# Altium schematic sheet SUBBOARD-boost_filter_3p_LCL.SchDoc
size A4
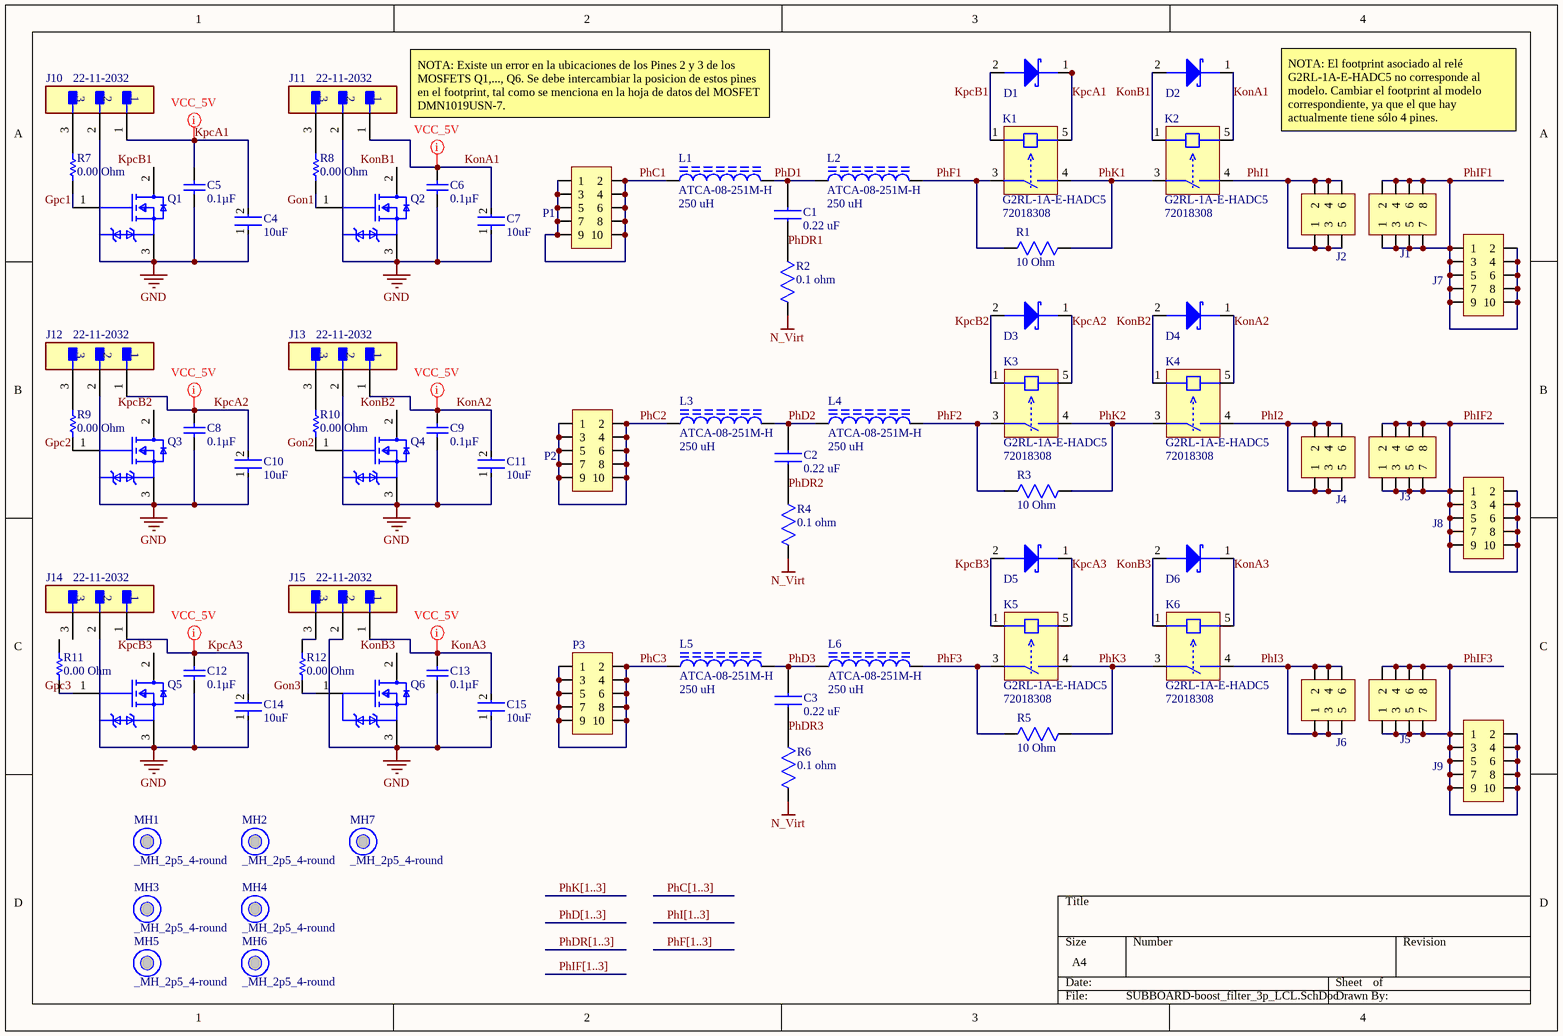
[diagram p0: SUBBOARD-boost_filter_3p_LCL.SchDoc]

## Parts
C1  Capacitance: 0.22 uF  [B32652XXXXX]  (hidden comment: B32652A6224K)
C2  Capacitance: 0.22 uF  [B32652XXXXX]  (hidden comment: B32652A6224K)
C3  Capacitance: 0.22 uF  [B32652XXXXX]  (hidden comment: B32652A6224K)
C4  value 10uF  [FP-GRT31-0_2-MFG]  (hidden comment: GRT31CR61H106KE01L)
C5  Capacitance: 0.1µF  [SAMS-C0603-2_L]  (hidden comment: CL10B104KB8NNNC)
C6  Capacitance: 0.1µF  [SAMS-C0603-2_L]  (hidden comment: CL10B104KB8NNNC)
C7  value 10uF  [FP-GRT31-0_2-MFG]  (hidden comment: GRT31CR61H106KE01L)
C8  Capacitance: 0.1µF  [SAMS-C0603-2_L]  (hidden comment: CL10B104KB8NNNC)
C9  Capacitance: 0.1µF  [SAMS-C0603-2_L]  (hidden comment: CL10B104KB8NNNC)
C10  value 10uF  [FP-GRT31-0_2-MFG]  (hidden comment: GRT31CR61H106KE01L)
C11  value 10uF  [FP-GRT31-0_2-MFG]  (hidden comment: GRT31CR61H106KE01L)
C12  Capacitance: 0.1µF  [SAMS-C0603-2_L]  (hidden comment: CL10B104KB8NNNC)
C13  Capacitance: 0.1µF  [SAMS-C0603-2_L]  (hidden comment: CL10B104KB8NNNC)
C14  value 10uF  [FP-GRT31-0_2-MFG]  (hidden comment: GRT31CR61H106KE01L)
C15  value 10uF  [FP-GRT31-0_2-MFG]  (hidden comment: GRT31CR61H106KE01L)
D1  BYG23T-M3/TR  [BYG23T-M3/TR]  (value not drawn)
D2  BYG23T-M3/TR  [BYG23T-M3/TR]  (value not drawn)
D3  BYG23T-M3/TR  [BYG23T-M3/TR]  (value not drawn)
D4  BYG23T-M3/TR  [BYG23T-M3/TR]  (value not drawn)
D5  BYG23T-M3/TR  [BYG23T-M3/TR]  (value not drawn)
D6  BYG23T-M3/TR  [BYG23T-M3/TR]  (value not drawn)
J1  SSW-104-01-G-D  [SSW-104-01-G-D]  (value not drawn)
J2  SSW-103-01-G-D  [SSW-103-01-G-D]  (value not drawn)
J3  SSW-104-01-G-D  [SSW-104-01-G-D]  (value not drawn)
J4  SSW-103-01-G-D  [SSW-103-01-G-D]  (value not drawn)
J5  SSW-104-01-G-D  [SSW-104-01-G-D]  (value not drawn)
J6  SSW-103-01-G-D  [SSW-103-01-G-D]  (value not drawn)
J7  IPS1-105-01-L-D-RA  [IPS1-105-01-L-D-RA]  (value not drawn)
J8  IPS1-105-01-L-D-RA  [IPS1-105-01-L-D-RA]  (value not drawn)
J9  IPS1-105-01-L-D-RA  [IPS1-105-01-L-D-RA]  (value not drawn)
J10  22-11-2032  [FP-22-11-2032-MFG]
J11  22-11-2032  [FP-22-11-2032-MFG]
J12  22-11-2032  [FP-22-11-2032-MFG]
J13  22-11-2032  [FP-22-11-2032-MFG]
J14  22-11-2032  [FP-22-11-2032-MFG]
J15  22-11-2032  [FP-22-11-2032-MFG]
K1  G2RL-1A-E-HADC5  Supplier Part Number 1: 72018308  [G2RL-1A-E-HA DC5]
K2  G2RL-1A-E-HADC5  Supplier Part Number 1: 72018308  [G2RL-1A-E-HA DC5]
K3  G2RL-1A-E-HADC5  Supplier Part Number 1: 72018308  [G2RL-1A-E-HA DC5]
K4  G2RL-1A-E-HADC5  Supplier Part Number 1: 72018308  [G2RL-1A-E-HA DC5]
K5  G2RL-1A-E-HADC5  Supplier Part Number 1: 72018308  [G2RL-1A-E-HA DC5]
K6  G2RL-1A-E-HADC5  Supplier Part Number 1: 72018308  [G2RL-1A-E-HA DC5]
L1  ATCA-08-251M-H  Inductance: 250 uH  [ATCA-08-251M-H]
L2  ATCA-08-251M-H  Inductance: 250 uH  [ATCA-08-251M-H]
L3  ATCA-08-251M-H  Inductance: 250 uH  [ATCA-08-251M-H]
L4  ATCA-08-251M-H  Inductance: 250 uH  [ATCA-08-251M-H]
L5  ATCA-08-251M-H  Inductance: 250 uH  [ATCA-08-251M-H]
L6  ATCA-08-251M-H  Inductance: 250 uH  [ATCA-08-251M-H]
MH1  _MH_2p5_4-round  [_MH_2p5_4-round]
MH2  _MH_2p5_4-round  [_MH_2p5_4-round]
MH3  _MH_2p5_4-round  [_MH_2p5_4-round]
MH4  _MH_2p5_4-round  [_MH_2p5_4-round]
MH5  _MH_2p5_4-round  [_MH_2p5_4-round]
MH6  _MH_2p5_4-round  [_MH_2p5_4-round]
MH7  _MH_2p5_4-round  [_MH_2p5_4-round]
P1  IPT1-105-01-S-D-RA  [IPT1-105-01-S-D-RA]  (value not drawn)
P2  IPT1-105-01-S-D-RA  [IPT1-105-01-S-D-RA]  (value not drawn)
P3  IPT1-105-01-S-D-RA  [IPT1-105-01-S-D-RA]  (value not drawn)
Q1  DMN1019USN-7  [FP-SC59-IPC_B]  (value not drawn)
Q2  DMN1019USN-7  [FP-SC59-IPC_B]  (value not drawn)
Q3  DMN1019USN-7  [FP-SC59-IPC_B]  (value not drawn)
Q4  DMN1019USN-7  [FP-SC59-IPC_B]  (value not drawn)
Q5  DMN1019USN-7  [FP-SC59-IPC_B]  (value not drawn)
Q6  DMN1019USN-7  [FP-SC59-IPC_B]  (value not drawn)
R1  Resistance: 10 Ohm  [RES_WH/NE]  (hidden comment: WHE10RFET)
R2  Resistance: 0.1 ohm  [WSR-L]  (hidden comment: WSR5R1000FEA)
R3  Resistance: 10 Ohm  [RES_WH/NE]  (hidden comment: WHE10RFET)
R4  Resistance: 0.1 ohm  [WSR-L]  (hidden comment: WSR5R1000FEA)
R5  Resistance: 10 Ohm  [RES_WH/NE]  (hidden comment: WHE10RFET)
R6  Resistance: 0.1 ohm  [WSR-L]  (hidden comment: WSR5R1000FEA)
R7  value 0.00 Ohm  [RESC0603(1608)_L]  (hidden comment: Jumper 0603(1608))
R8  value 0.00 Ohm  [RESC0603(1608)_L]  (hidden comment: Jumper 0603(1608))
R9  value 0.00 Ohm  [RESC0603(1608)_L]  (hidden comment: Jumper 0603(1608))
R10  value 0.00 Ohm  [RESC0603(1608)_L]  (hidden comment: Jumper 0603(1608))
R11  value 0.00 Ohm  [RESC0603(1608)_L]  (hidden comment: Jumper 0603(1608))
R12  value 0.00 Ohm  [RESC0603(1608)_L]  (hidden comment: Jumper 0603(1608))

## Nets
GND: C4.1 C5.2 C6.2 C7.1 C8.2 C9.2 C10.1 C11.1 C12.2 C13.2 C14.1 C15.1 J10.2 J11.2 J12.2 J13.2 J14.2 J15.2 Q1.3(D) Q2.3(D) Q3.3(D) Q4.3(D) Q5.3(D) Q6.3(D)
N_Virt: R2.1 R4.1 R6.1
Gon1: Q2.1(G) R8.2
Gon2: Q4.1(G) R10.2
Gon3: Q6.1(G) R12.2
Gpc1: Q1.1(G) R7.2
Gpc2: Q3.1(G) R9.2
Gpc3: Q5.1(G) R11.2
KonA1: C6.1 C7.2 D2.1(Cathode) J11.1 K2.5
KonA2: C9.1 C11.2 D4.1(Cathode) J13.1 K4.5
KonA3: C13.1 C15.2 D6.1(Cathode) J15.1 K6.5
KonB1: D2.2(Anode) K2.1 Q2.2(S)
KonB2: D4.2(Anode) K4.1 Q4.2(S)
KonB3: D6.2(Anode) K6.1 Q6.2(S)
KpcA1: C4.2 C5.1 D1.1(Cathode) J10.1 K1.5
KpcA2: C8.1 C10.2 D3.1(Cathode) J12.1 K3.5
KpcA3: C12.1 C14.2 D5.1(Cathode) J14.1 K5.5
KpcB1: D1.2(Anode) K1.1 Q1.2(S)
KpcB2: D3.2(Anode) K3.1 Q3.2(S)
KpcB3: D5.2(Anode) K5.1 Q5.2(S)
PhC1: L1.1 P1.1 P1.2 P1.3 P1.4 P1.5 P1.6 P1.7 P1.8 P1.9 P1.10
PhC2: L3.1 P2.1 P2.2 P2.3 P2.4 P2.5 P2.6 P2.7 P2.8 P2.9 P2.10
PhC3: L5.1 P3.1 P3.2 P3.3 P3.4 P3.5 P3.6 P3.7 P3.8 P3.9 P3.10
PhD1: C1.2 L1.2 L2.1
PhD2: C2.2 L3.2 L4.1
PhD3: C3.2 L5.2 L6.1
PhDR1: C1.1 R2.2
PhDR2: C2.1 R4.2
PhDR3: C3.1 R6.2
PhF1: K1.3 L2.2 R1.1
PhF2: K3.3 L4.2 R3.1
PhF3: K5.3 L6.2 R5.1
PhI1: J2.1 J2.2 J2.3 J2.4 J2.5 J2.6 K2.4
PhI2: J4.1 J4.2 J4.3 J4.4 J4.5 J4.6 K4.4
PhI3: J6.1 J6.2 J6.3 J6.4 J6.5 J6.6 K6.4
PhIF1: J1.1 J1.2 J1.3 J1.4 J1.5 J1.6 J1.7 J1.8 J7.1 J7.2 J7.3 J7.4 J7.5 J7.6 J7.7 J7.8 J7.9 J7.10
PhIF2: J3.1 J3.2 J3.3 J3.4 J3.5 J3.6 J3.7 J3.8 J8.1 J8.2 J8.3 J8.4 J8.5 J8.6 J8.7 J8.8 J8.9 J8.10
PhIF3: J5.1 J5.2 J5.3 J5.4 J5.5 J5.6 J5.7 J5.8 J9.1 J9.2 J9.3 J9.4 J9.5 J9.6 J9.7 J9.8 J9.9 J9.10
PhK1: K1.4 K2.3 R1.2
PhK2: K3.4 K4.3 R3.2
PhK3: K5.4 K6.3 R5.2
NetJ10_3: J10.3 R7.1
NetJ11_3: J11.3 R8.1
NetJ12_3: J12.3 R9.1
NetJ13_3: J13.3 R10.1
NetJ15_3: J15.3 R12.1

Not connected (* = marked no-connect by the designer): J14 3; R11 1

## Buses and harness runs
bus PhC[1..3]
bus PhD[1..3]
bus PhDR[1..3]
bus PhF[1..3]
bus PhI[1..3]
bus PhIF[1..3]
bus PhK[1..3]

## Layout directives
mark named VCC_5V: KonA1, KonA2, KonA3, KpcA1, KpcA2, KpcA3

## Notes on the sheet
- NOTA: Existe un error en la ubicaciones de los Pines 2 y 3 de los MOSFETS Q1,..., Q6. Se debe intercambiar la posicion de estos pines en el footprint, tal como se menciona en la hoja de datos del MOSFET DMN1019USN-7.
- NOTA: El footprint asociado al relé G2RL-1A-E-HADC5 no corresponde al modelo. Cambiar el footprint al modelo correspondiente, ya que el que hay actualmente tiene sólo 4 pines.

## Library data of the parts
C1-C3 = B32652A6224K: Film Capacitors 0.22uF 630volts 5%; Vendor: Epcos; Built_By: EMA_UL_Team; Type: DEV; Voltage Rating AC: 250 VAC; Voltage Rating DC: 630 VDC; Manufacturer_Part_Number: B32652A6224K; Copyright: Copyright (C) 2018 Accelerated Designs. All rights reserved; RefDes: RefDes; Value: Value; Supplier 1: Mouser; Supplier 2: Arrow; Supplier Part Number 2: B32652A6224J189; Supplier Part Number 1: 871-B32652A6224J189
C4 C7 C10 C11 C14 C15 = CMP-06035-000076-1: CAP CER 10UF 50V X5R 1206; Manufacturer: Murata; Temperature Coefficient: 15%; Tolerance: 10%; Material: Ceramic; Automotive Grade: Grade 3; Height: 1.8mm; Ipc Land Pattern Name: CAPC320160X160; Octopart: https://octopart.com/grt31cr61h106ke01l-murata-62921736; Digikey Description: CAP CER 10UF 50V X5R 1206; Voltage Rating: 50V; Device Class L3: Ceramic Capacitors; ComponentLink2URL: https://search.murata.co.jp/Ceramy/image/img/A01X/G101/ENG/GRT31CR61H106KE01-01.pdf; Device Class L1: Passive Components; Temperature Range High: +85°C; Lead Free: Yes; Capacitance: 10uF; Manufacturer Part Number: GRT31CR61H106KE01L; Temperature Range Low: -55°C; Temperature Characteristic: X5R; Category: Cap; Automotive: Yes; ComponentLink2Description: Datasheet; Device Class L2: Capacitors; Package: GRT31-0.2; RoHS: TRUE; Temperature: -55°C to +85°C
C5 C6 C8 C9 C12 C13 = CMP-2000-05332-1: Multi-layer Ceramic Capacitor, -55 to 125 degC, 2-Pin SMD (0603), RoHS, Tape and Reel; Manufacturer: Samsung Electro-Mechanics; Rated Voltage: 50V; Dielectric: X7R; Tolerance (%): ±10%; Case Size/Dimension: 0603; Datasheet URL: https://datasheet.ciiva.com/29198/456651-da-01-en-vs-kondensator-0605-29198839.pdf; Manufacturer URL: http://www.samsungsem.com/global/index.jsp; Datasheet Version: Nov-10
D1-D6 = BYG23T-M3/TR: DIODE AVALANCHE 1300V 1A DO214AC; Manufacturer: Vishay Semiconductors; Max Surge Current: 18A; Forward Voltage: 1.9V; Peak Reverse Current: 5uA; Recovery Time: 75ns; Max Repetitive Reverse Voltage (Vrrm): 1.3kV; Zener Voltage: 200V; Max Power Dissipation: 800mW; Element Configuration: Single; Supplier 1: Newark; Manufacturer Part Number: BYG23T-M3/TR; RoHS: Yes; Category: Rectifier Diodes; Stock 1: 6980; Pricing 1: 1=0.16100, 10=0.16100, 25=0.16100, 50=0.16100, 100=0.16100, 250=0.16100, 500=0.16100, 1000=0.14800 (USD); Mount: Surface Mount; Case/Package: SMA; Number of Pins: 2; Contact Plating: Tin,Matte; Min Operating Temperature: -55°C; Max Operating Temperature: 150°C; Packaging: Tape and Reel; Forward Current: 1A; Package Quantity: 1; Average Rectified Current: 1A; Reverse Recovery Time: 75ns; Max Forward Surge Current (Ifsm): 18A; Peak Non-Repetitive Surge Current: 18A; Diode Type: Avalanche; Max Reverse Voltage (DC): 1.3kV; Reverse Voltage: 1.3kV; Length: 4.5mm; Height: 2.29mm; Width: 2.79mm; Radiation Hardening: No; REACH SVHC: Unknown; ComponentLink1URL: https://datasheet.ciiva.com/23642/byg23t-23642320.pdf?src-supplier=Newark; ComponentLink1Description: https://datasheet.ciiva.com/23642/byg23t-23642320.pdf?src-supplier=Newark; ComponentLink2URL: https://datasheet.ciiva.com/30479/0900766b810d43bd-30479333.pdf?src-supplier=RSComponents; ComponentLink2Description: https://datasheet.ciiva.com/30479/0900766b810d43bd-30479333.pdf?src-supplier=RSComponents; ComponentLink3URL: https://datasheet.ciiva.com/4454/byg23t-85630-4454047.pdf?src-supplier=Mouser; ComponentLink3Description: https://datasheet.ciiva.com/4454/byg23t-85630-4454047.pdf?src-supplier=Mouser; ComponentLink4URL: https://datasheet.ciiva.com/920/byg23t-920130.pdf?src-supplier=Digi-Key; ComponentLink4Description: https://datasheet.ciiva.com/920/byg23t-920130.pdf?src-supplier=Digi-Key; ComponentLink5URL: https://datasheet.ciiva.com/920/byg23t-920131.pdf?src-supplier=Digi-Key; ComponentLink5Description: https://datasheet.ciiva.com/920/byg23t-920131.pdf?src-supplier=Digi-Key; ComponentLink6URL: https://datasheet.ciiva.com/920/byg23t-920132.pdf?src-supplier=Digi-Key; ComponentLink6Description: https://datasheet.ciiva.com/920/byg23t-920132.pdf?src-supplier=Digi-Key; ComponentLink7URL: https://datasheet.ciiva.com/1178/byg23t-1178213.pdf?src-supplier=Element14; ComponentLink7Description: https://datasheet.ciiva.com/1178/byg23t-1178213.pdf?src-supplier=Element14; Supplier Part Number 1: 70AC6454
J1 J3 J5 = SSW-104-01-G-D: Conn Socket Strip SKT 8 POS 2.54mm Solder ST Thru-Hole; Manufacturer: Samtec; Number of Contacts: 8; Max Current Rating: 6.9A; Contact Resistance: 10mR; Max Voltage Rating (AC): 550V; Gender: Receptacle; Connector Type: Receptacle,Socket; Mating Cycles: 100; Row Spacing: 0.1inch; Supplier 1: Digi-Key; Manufacturer Part Number: SSW-104-01-G-D; RoHS: Yes; Category: Headers and Wire Housings; Stock 1: 1152; Pricing 1: 1=1.24000, 10=1.09400, 25=1.03000, 50=0.98700, 100=0.94410, 250=0.85824, 500=0.77242 (USD); Mount: Through Hole; Contact Plating: Gold; Contact Material: Bronze; Color: Black; Housing Color: Black; Housing Material: Polymer; Min Operating Temperature: -55°C; Max Operating Temperature: 125°C; Number of Rows: 2; Termination: Solder; Packaging: Bulk; Orientation: Vertical; Number of Positions: 8; Current Rating: 6.9A; Voltage Rating: 550V; Length: 10.67mm; Pitch: 2.54mm; Depth: 4.95mm; Radiation Hardening: No; Lead Free: Lead Free; REACH SVHC: No SVHC; ComponentLink1URL: https://datasheet.ciiva.com/25617/0900766b8115c03d-25617355.pdf?src-supplier=RSComponents; ComponentLink1Description: https://datasheet.ciiva.com/25617/0900766b8115c03d-25617355.pdf?src-supplier=RSComponents; ComponentLink2URL: https://datasheet.ciiva.com/22677/82032-22677624.pdf?src-supplier=Element14; ComponentLink2Description: https://datasheet.ciiva.com/22677/82032-22677624.pdf?src-supplier=Element14; ComponentLink3URL: https://datasheet.ciiva.com/749/ssw-1xx-xx-xxx-x-xx-xxx-xx-mkt-749827.pdf?src-supplier=Digi-Key; ComponentLink3Description: https://datasheet.ciiva.com/749/ssw-1xx-xx-xxx-x-xx-xxx-xx-mkt-749827.pdf?src-supplier=Digi-Key; Supplier Part Number 1: SAM1208-04-ND
J2 J4 J6 = SSW-103-01-G-D: Conn Socket Strip SKT 6 POS 2.54mm Solder ST Thru-Hole; Manufacturer: Samtec; Number of Contacts: 6; Gender: Receptacle; Connector Type: Receptacle,Socket; Contact Resistance: 10mR; Max Current Rating: 6.9A; Max Voltage Rating (AC): 550V; Mating Cycles: 100; Row Spacing: 0.1inch; Supplier 1: Digi-Key; Manufacturer Part Number: SSW-103-01-G-D; RoHS: Yes; Category: Headers and Wire Housings; Stock 1: 1397; Pricing 1: 1=0.93000, 10=0.82100, 25=0.77240, 50=0.74020, 100=0.70800, 250=0.64368, 500=0.57932 (USD); Mount: Through Hole; Contact Plating: Gold; Contact Material: Bronze; Color: Black; Housing Color: Black; Housing Material: Polymer; Min Operating Temperature: -55°C; Max Operating Temperature: 125°C; Number of Rows: 2; Termination: Solder; Packaging: Bulk; Number of Positions: 6; Orientation: Vertical; Current Rating: 6.9A; Voltage Rating: 550V; Length: 8.13mm; Pitch: 2.54mm; Depth: 4.95mm; Radiation Hardening: No; Lead Free: Lead Free; REACH SVHC: No SVHC; ComponentLink1URL: https://datasheet.ciiva.com/25617/0900766b8115c03d-25617399.pdf?src-supplier=RSComponents; ComponentLink1Description: https://datasheet.ciiva.com/25617/0900766b8115c03d-25617399.pdf?src-supplier=RSComponents; ComponentLink2URL: https://datasheet.ciiva.com/22677/82032-22677622.pdf?src-supplier=Element14; ComponentLink2Description: https://datasheet.ciiva.com/22677/82032-22677622.pdf?src-supplier=Element14; ComponentLink3URL: https://datasheet.ciiva.com/749/ssw-1xx-xx-xxx-x-xx-xxx-xx-mkt-749828.pdf?src-supplier=Digi-Key; ComponentLink3Description: https://datasheet.ciiva.com/749/ssw-1xx-xx-xxx-x-xx-xxx-xx-mkt-749828.pdf?src-supplier=Digi-Key; Supplier Part Number 1: SAM1208-03-ND; Supplier 2: Arrow; Stock 2: 1; Pricing 2: 1=0.94640, 1=0.93000, 4167=0.71590, 8334=0.59720, 41667=0.52200, 83334=0.49330 (USD); Supplier 3: Mouser; Stock 3: 388; Pricing 3: 1=1.35000, 10=1.10000, 100=0.98200, 250=0.91700, 500=0.79200, 1000=0.69000 (USD); Supplier Part Number 2: SSW-103-01-G-D; Supplier Part Number 3: 200-SSW10301GD
J7-J9 = IPS1-105-01-L-D-RA: SAMTEC         IPS1-105-01-L-D-RA             Board-To-Board Connector, Right Angle, IPS1 Series, 10 Contacts, Receptacle, 2.54 mm, Through Hole; Number of Contacts: 10; Number of Ports: 1; Max Voltage Rating (AC): 550V; Current Rating: 9A; Voltage Rating: 777V; Pitch: 2.54mm; Supplier 1: Digi-Key; Manufacturer: Samtec; Manufacturer Part Number: IPS1-105-01-L-D-RA; RoHS: Yes; Category: Connectors; Stock 1: 364; Pricing 1: 1=2.75000, 10=2.64000, 100=2.20000, 500=1.87000, 1000=1.59500, 5000=1.43000 (USD); Mount: Through Hole,Surface Mount; Number of Terminals: 10; Contact Material: Bronze; Contact Plating: Gold; Housing Material: Polymer; Min Operating Temperature: -55°C; Max Operating Temperature: 125°C; Termination: Solder; Orientation: Right Angle; Packaging: Bulk; Gender: Receptacle; Number of Rows: 2; Length: 13.08mm; Depth: 8.51mm; Radiation Hardening: No; REACH SVHC: No SVHC; ComponentLink1URL: https://datasheet.ciiva.com/25618/0900766b8114c2ed-25618027.pdf?src-supplier=RSComponents; ComponentLink1Description: https://datasheet.ciiva.com/25618/0900766b8114c2ed-25618027.pdf?src-supplier=RSComponents; ComponentLink2URL: https://datasheet.ciiva.com/9444/ipt1-9444586.pdf?src-supplier=Avnet; ComponentLink2Description: https://datasheet.ciiva.com/9444/ipt1-9444586.pdf?src-supplier=Avnet; Supplier Part Number 1: SAM9620-ND
J10-J15 = CMP-04776-000113-1: CONN HEADER VERT 3POS 2.54MM; Manufacturer: Molex; Number Of Contacts: 3; Voltage Rating: 500V; Conn Gender: Male; Current Rating: 4A; Conn Orientation: Vertical; Device Class L2: Headers and Wire Housings; Number Of Rows: 1; Temperature Range High: +80°C; RoHS: TRUE; ComponentLink2URL: https://www.molex.com/webdocs/datasheets/pdf/en-us/0022112032_PCB_HEADERS.pdf; Manufacturer Part Number: 22-11-2032; Device Class L3: unset; Automotive: No; Temperature: -40°C to +80°C; Temperature Range Low: -40°C; Lead Free: Yes; Pitch: 2.54mm; Footprint Url: https://www.molex.com/pdm_docs/sd/022112032_sd.pdf; Digikey Description: CONN HEADER VERT 3POS 2.54MM; Contact Material: Gold,Nickel; Octopart: https://octopart.com/22-11-2032-molex-10085; Height: 10.91mm; Mouser Description: KK® 254 Solid Header, Vertical, with Friction Lock, 3 Circuits, Gold (Au) Plating; Package: 22-11-2032; Device Class L1: Connectors; Mounting Type: Through Hole; ComponentLink2Description: Datasheet; Category: Conn
K1-K6 = G2RL-1A-E-HADC5: General Purpose Relays PCB Power Relay Low Profile 16A SPST-NO 5V coil voltage; Manufacturer: Omron; Relay Contact Form: 1 form A (SPST-NO); Switching Voltage: 440VAC; 300VDC; Coil Current: 80 mA; Coil Voltage: 5 VDC; Power Consumption: 400 mW; Supplier 1: Allied Electronics; Manufacturer Part Number: G2RL-1A-E-HADC5; RoHS: No; Pricing 1: 100=2,510000 (USD); Contact Current: 16 A
L1-L6 = ATCA-08-251M-H: Fixed Inductors 250uH 27 mOhm Max -40 C - 105 C - ABRACON; Maximum DC current: 10 A; Maximum DC Resistance: 27 mOhm; Lead Diameter: 1.6 mm; Diameter: 42.5 mm; Supplier 1: Digi-Key; Supplier 2: Mouser; Supplier 3: Arrow; Supplier Part Number 1: 535-13511-ND; Supplier Part Number 2: 815-ATCA-08-251M-H; Supplier Part Number 3: ATCA-08-251M-H
MH1-MH7 = _MH_2p5_4-round: matching hole 2.5 hole, 4mm pad (round)
P1-P3 = IPT1-105-01-S-D-RA: CONN PLUG .100" 10POS DL PCB R/A; Manufacturer: Samtec; Number of Contacts: 10; Gender: Male; Connector Type: Male Pin; Number of Ports: 1; Max Voltage Rating (AC): 550V; Max Current Rating: 8A; Pitch: 2.54mm; Row Spacing: 0.1inch; Supplier 1: Digi-Key; Manufacturer Part Number: IPT1-105-01-S-D-RA; RoHS: Yes; Category: Connectors; Stock 1: 449; Pricing 1: 1=3.53000, 10=3.38400, 100=2.82000, 500=2.39700, 1000=2.04450, 5000=1.83300 (USD); Mount: Through Hole; Contact Material: Bronze; Contact Plating: Gold; Housing Material: Polymer; Number of Terminals: 10; Housing Color: Black; Color: Black; Min Operating Temperature: -55°C; Max Operating Temperature: 125°C; Termination: Solder; Orientation: Right Angle; Packaging: Rail/Tube; Number of Rows: 2; Number of Positions: 10; Length: 13.21mm; Depth: 10.39mm; Contact Mating Length: 0.155inch; Radiation Hardening: No; REACH SVHC: No SVHC; Lead Free: Lead Free; ComponentLink1URL: https://datasheet.ciiva.com/716/ipt1-1xx-xx-xx-d-ra-xxx-mkt-716221.pdf?src-supplier=Digi-Key; ComponentLink1Description: https://datasheet.ciiva.com/716/ipt1-1xx-xx-xx-d-ra-xxx-mkt-716221.pdf?src-supplier=Digi-Key; ComponentLink2URL: https://datasheet.ciiva.com/7997/81376-7997581.pdf?src-supplier=Element14; ComponentLink2Description: https://datasheet.ciiva.com/7997/81376-7997581.pdf?src-supplier=Element14; ComponentLink3URL: https://datasheet.ciiva.com/9444/ipt1-9444638.pdf?src-supplier=Avnet; ComponentLink3Description: https://datasheet.ciiva.com/9444/ipt1-9444638.pdf?src-supplier=Avnet; Supplier Part Number 1: SAM8101-ND
Q1-Q6 = CMP-12801-000099-1: MOSFET N-CH 12V 9.3A SC59; Turn-On Delay Time: 7.6ns; Rds On Max: 10mR; Element Configuration: Single; Fall Time: 16.8ns; Rise Time: 57.6ns; Turn-Off Delay Time: 22.2ns; Input Capacitance: 2.426nF; Capacitance: 2.426E-09F; Max Power Dissipation: 680mW; Gate to Source Voltage (Vgs): 4.5V; Drain to Source Resistance: 41mR; Number of Channels: 1; Min Operating Temperature: -55°C; Max Operating Temperature: 150°C; Packaging: Tape and Reel; Mount: Surface Mount; Weight: 0.000282oz; Case/Package: TO-236-3; Drain to Source Breakdown Voltage: 12V; Drain to Source Voltage (Vdss): 12V; Continuous Drain Current (ID): 9.3A; Lead Free: Lead Free; Package Quantity: 3000
R1 R3 R5 = WHE10RFET: Wirewound Resistors - Through Hole 5W 10 ohm 1%; Vendor: Ohmite; Built_By: EMA_UL_Team; Manufacturer_Part_Number: WHE10RFET; Copyright: Copyright (C) 2018 Accelerated Designs. All rights reserved; RefDes: RefDes; Type: DEV; Value: Value; Power rating: 5 W; Tolerance: 1%; Supplier 1: Digi-Key; Supplier 2: Mouser; Supplier 3: Farnell; Supplier 4: Newark; Supplier Part Number 1: WHE10RFETCT-ND; Supplier Part Number 2: 588-WHE10RFET; Supplier Part Number 3: 2099554; Supplier Part Number 4: 13T1795
R2 R4 R6 = WSR5R1000FEA: RES 0.1 OHM 1% 5W 4527; Vendor: Vishay; Built_By: EMA_UL_Team; Value: 0.1ohm; Manufacturer_Part_Number: WSR5R1000FEA; Copyright: Copyright (C) 2018 Accelerated Designs. All rights reserved; RefDes: RefDes; Type: DEV
R7-R12 = CMP-1012-00001-1: Jumper 0603 (1608 Metric); Case-Metric: 1608; Power: None; Case-EIA: 0603; Technology: SMT; Tolerance: None